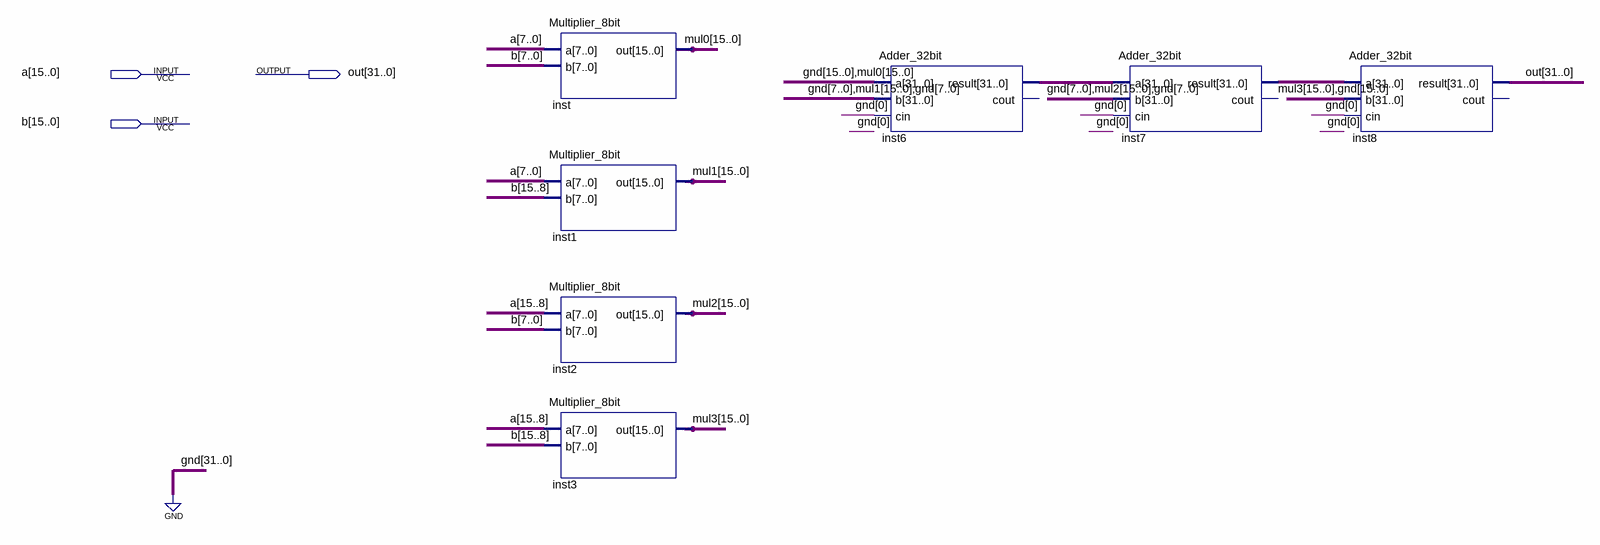
[diagram p0: schematic sheet]
// Quartus schematic Multiplier_16bit.bdf as structural Verilog: 7 symbols, 3 pins
module Multiplier_16bit (
  input  [15:0] a,
  input  [15:0] b,
  output [31:0] out
);

  wire [15:0] mul0, mul1, mul2, mul3;
  wire [31:0] inst6_result, inst7_result;

  Multiplier_8bit inst (.a(a[7:0]), .b(b[7:0]), .out(mul0));
  Multiplier_8bit inst1 (.a(a[7:0]), .b(b[15:8]), .out(mul1));
  Multiplier_8bit inst2 (.a(a[15:8]), .b(b[7:0]), .out(mul2));
  Multiplier_8bit inst3 (.a(a[15:8]), .b(b[15:8]), .out(mul3));
  Adder_32bit inst6 (
    .a({{16{1'b0}}, mul0}), .b({{8{1'b0}}, mul1, {8{1'b0}}}), .cin(1'b0), .result(inst6_result));  // open: cout
  Adder_32bit inst7 (
    .a(inst6_result), .b({{8{1'b0}}, mul2, {8{1'b0}}}), .cin(1'b0), .result(inst7_result));  // open: cout
  Adder_32bit inst8 (.a(inst7_result), .b({mul3, {16{1'b0}}}), .cin(1'b0), .result(out));  // open: cout
endmodule
